# Altium schematic sheet NB679.SchDoc
size A4; SheetNumber: 3; SheetTotal: 16
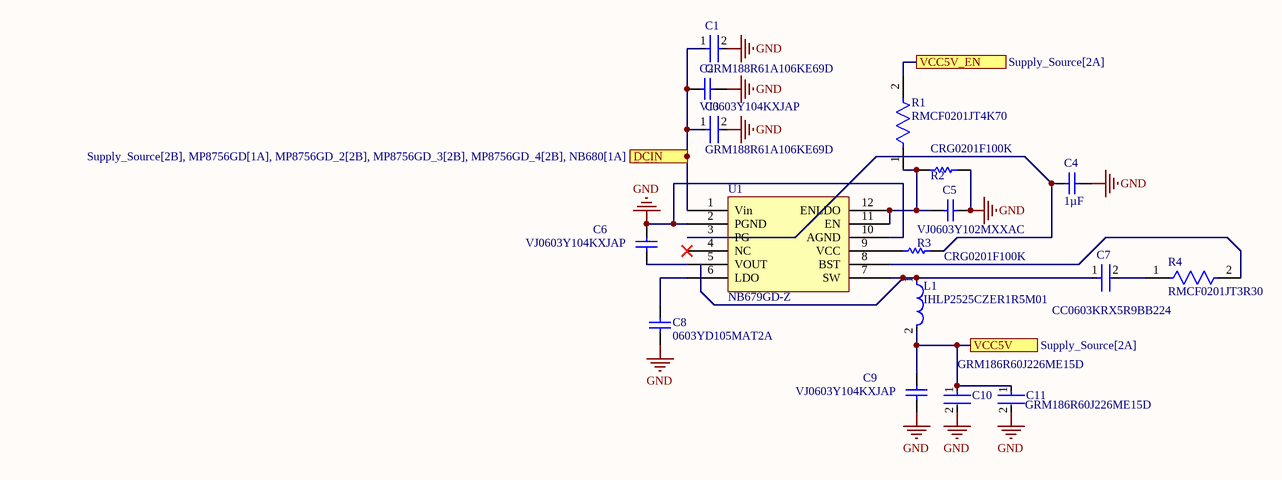
[diagram p0: NB679.SchDoc]

## Parts
C1  GRM188R61A106KE69D  [FP-GRM18-0_15-MFG]
C2  VJ0603Y104KXJAP  [CAPC1608X92X38NL15T08]
C3  GRM188R61A106KE69D  [FP-GRM18-0_15-MFG]
C4  value 1µF  [CAPC1608X90X35LL15T15]  (hidden comment: 0603YD105MAT2A)
C5  VJ0603Y102MXXAC  [CAPC1608X92X38NL15T08]
C6  VJ0603Y104KXJAP  [CAPC1608X92X38NL15T08]
C7  CC0603KRX5R9BB224  [FP-CC0603-DA-MFG]
C8  0603YD105MAT2A  [CAPC1608X90X35NL15T15]
C9  VJ0603Y104KXJAP  [CAPC1608X92X38NL15T08]
C10  GRM186R60J226ME15D  [FP-GRM186-0_2-IPC_B]
C11  GRM186R60J226ME15D  [FP-GRM186-0_2-IPC_B]
L1  IHLP2525CZER1R5M01  [FP-IHLP-2525CZ-FP_2_413x3-MFG]
R1  RMCF0201JT4K70  [FP-RMCF0201-IPC_C]
R2  CRG0201F100K  [RESC0603X26X15LL03T05]
R3  CRG0201F100K  [RESC0603X26X15LL03T05]
R4  RMCF0201JT3R30  [FP-RMCF0201-IPC_A]
U1  NB679GD-Z  [NB679GD-Z-Footprint-1]

## Ports
DCIN (see Supply_Source[2B], MP8756GD[1A], MP8756GD_2[2B], MP8756GD_3[2B], MP8756GD_4[2B], NB680[1A]), VCC5V (see Supply_Source[2A]), VCC5V_EN (see Supply_Source[2A])

## Nets
GND: C1.2 C2.1 C3.2 C4.1 C5.2 C6.2 C8.2 C9.1 C10.2 C11.2 R2.2 U1.2(PGND) U1.10(AGND)
DCIN: C1.1 C2.2 C3.1 U1.1(Vin) ; port DCIN
VCC5V: C9.2 C10.1 C11.1 L1.2 ; port VCC5V
VCC5V_EN: R1.2 ; port VCC5V_EN
NetC4_2: C4.2 R3.2 U1.3(PG)
NetC5_1: C5.1 R1.1 R2.1 U1.11(EN) U1.12(ENLDO)
NetC6_1: C6.1 U1.5(VOUT)
NetC7_1: C7.1 L1.1 U1.7(SW)
NetC7_2: C7.2 R4.1
NetC8_1: C8.1 U1.6(LDO)
NetR3_1: R3.1 U1.9(VCC)
NetR4_2: R4.2 U1.8(BST)

Not connected (* = marked no-connect by the designer): U1 4(NC)*

## Library data of the parts
C1 C3 = CMP-2000-05448-2: CAP CER 10UF 10V X5R 0603; Manufacturer: Murata; Temperature Coefficient: 15%; Material: Ceramic; Tolerance: 10%; Device Class L1: Passive Components; ComponentLink2Description: Datasheet; Height: 0.95mm; Package: GRM18-0.15; Octopart: https://octopart.com/grm188r61a106ke69d-murata-22851381; Manufacturer Part Number: GRM188R61A106KE69D; Value: 10uF; Digikey Description: CAP CER 10UF 10V X5R 0603; Temperature Range High: +85°C; Temperature Range Low: -55°C; Temperature Characteristic: X5R; Capacitance: 10uF; RoHS: TRUE; Device Class L2: Capacitors; ComponentLink2URL: https://search.murata.co.jp/Ceramy/image/img/A01X/G101/ENG/GRM188R61A106KE69-01A.pdf; Device Class L3: Ceramic Capacitors; Lead Free: Yes; Mouser Description: Multilayer Ceramic Capacitors MLCC - SMD/SMT 0603 10uF 10volts X5R + - 10%; Category: Cap; Voltage Rating: 10V; Temperature: -55°C to +85°C; Automotive: No
C2 C6 C9 = CMP-2006-01211-1: Manufacturer: Vitramon; Part Number: VJ0603Y104KXJAP
C4 = CMP-001-00098-1: 0603 1 uF 16 V ±20 % Tolerance X5R Surface Mount Multilayer Ceramic Capacitor; Tolerance: 20%; Voltage Rating: 16V; Min Operating Temperature: -55°C; Mounting Technology: Surface Mount; Case/Package: 0603; Max Operating Temperature: 85°C; Pins: 2
C5 = CMP-2006-01229-1: Manufacturer: Vitramon; Part Number: VJ0603Y102MXXAC
C7 = CMP-03422-000839-1: CC0603 220 nF X5R 10.00% 50 V; Manufacturer: YAGEO; Tolerance: 0.1; Capacitance: 220 nF; Temperature Coefficient: 15%; Material: Ceramic; Voltage Rating: 50 V; Value: 220 nF; Package: CC0603-DA; Temperature: -55°C to +125°C; Automotive: No; ComponentLink2URL: http://www.yageo.com/documents/recent/UPY-GPHC_X7R_6.3V-to-50V_18.pdf; Device Class L1: Passive Components; Footprint Url: http://www.yageo.com/exep/pages/download/literatures/UPY-C_GEN_24.pdf; Mouser Description: Surface Mount Ceramic Multilayer Capacitor 0.22uF 10% X5R 50V 0603 Paper T/R; Temperature Range Low: -55°C; ComponentLink2Description: Datasheet; Temperature Characteristic: X5R; Category: Cap; Octopart: https://octopart.com/cc0603krx5r9bb224-yageo-90326743; Device Class L3: Ceramic Capacitors; RoHS: TRUE; Device Class L2: Capacitors; Height: 0.9mm; Manufacturer Part Number: CC0603KRX5R9BB224; Temperature Range High: +125°C; Voltage: 50 V; Lead Free: Yes
C8 = CMP-2006-04534-1: Manufacturer: AVX Interconnect / Elco; Part Number: 0603YD105MAT2A
C10 C11 = CMP-06035-038491-1: Chip Multilayer Ceramic Capacitors for General Purpose, 0603, 22uF, X5R, 15%, 20%, 6.3V; Mount: Surface Mount; Thickness: 0.028inch; Tolerance: 20%; Width: 0.031inch; Voltage Rating (DC): 6.3V; Min Operating Temperature: -55°C; Voltage Rating: 6.3V; Capacitance: 22uF; Dielectric: X5R; Case Code (Imperial): 0603; Length: 0.063inch; Case/Package: 0603; Packaging: Tape and Reel; Case Code (Metric): 1608; Max Operating Temperature: 85°C
L1 = CMP-2000-06441-2: Commercial Inductors, High Saturation Series 1.5uH 9A 15mΩ 20%; DC Resistance (DCR): 15mR; Shielding: Shielded; Self Resonant Frequency: 5MHz; Max DC Current: 18A; Test Frequency: 100kHz; Core Material: Metal; Packaging: Tape and Reel; RMS Current (Irms): 9A; Length: 7.24mm; Case Code (Imperial): 2525; Case/Package: 2525; Min Operating Temperature: -55°C; Number of Pins: 2; Contact Plating: Tin; Height: 3mm; Height - Seated (Max): 0.118inch; Termination: SMD/SMT; Max Operating Temperature: 125°C; Depth: 6.72mm; Width: 6.47mm; Current Rating: 9A; Tolerance: 20%; Lead Free: Lead Free; Military Standard: Not; Radiation Hardening: No; Saturation Current: 18A; Package Quantity: 2000; Inductance Tolerance: 20%; Inductance: 1.5uH; Mount: Surface Mount
R1 = CMP-26527-001323-1: 4.7kΩ ±5% 0.05W 0201 Thick Film Chip Resistor AEC-Q200 compliant; Temperature Coefficient: 200ppm/°C; Resistance: 4.7kR; Max Power Dissipation: 50mW; Tolerance: 5%; Number of Terminations: 2; Width: 0.012inch; Case/Package: 0201; Resistor Type: Thick Film; Max Operating Temperature: 125°C; Height: 0.009inch; Mount: Surface Mount; RoHS Compliant: Yes; Packaging: Tape and Reel; Package Quantity: 1; Lead Free: Lead Free; Min Operating Temperature: -55°C; Contact Plating: Tin; Radiation Hardening: No; Case Code (Imperial): 0201; Series: RMCF; Length: 0.024inch; Case Code (Metric): 0603
R2 R3 = CMP-2004-03564-1: Manufacturer: TE Connectivity / AMP; Part Number: CRG0201F100K
R4 = CMP-26527-006332-1: 3.3Ω ±5% 0.05W 0201 Thick Film Chip Resistor AEC-Q200 compliant; Temperature Coefficient: 400ppm/°C; Resistance: 3.3R; Max Power Dissipation: 50mW; Mount: Surface Mount; Resistor Type: Thick Film; Series: RMCF; Tolerance: 5%; Contact Plating: Tin; Max Operating Temperature: 125°C; Radiation Hardening: No; Min Operating Temperature: -55°C; Height: 0.009inch; Number of Terminations: 2; Packaging: Tape and Reel; RoHS Compliant: Yes; Length: 0.024inch; Width: 0.012inch; Case/Package: 0201
U1 = CMP-019-00053-1: Step-Down (Buck) Synchronous (1), Linear (LDO) (1) QFN-12; Max Supply Voltage: 24V; Max Operating Temperature: 125°C; Min Operating Temperature: -40°C